# Altium schematic sheet DM1097_CM4.SchDoc: =project_title
size Tabloid; CompanyName: Luxonis Holding; Organization: Luxonis Holding; Address1: 1925 Harmony Park Drive; Address2: Westminster, CO; Address3: 80234; Address4: United States; SheetNumber: 9; SheetTotal: 17
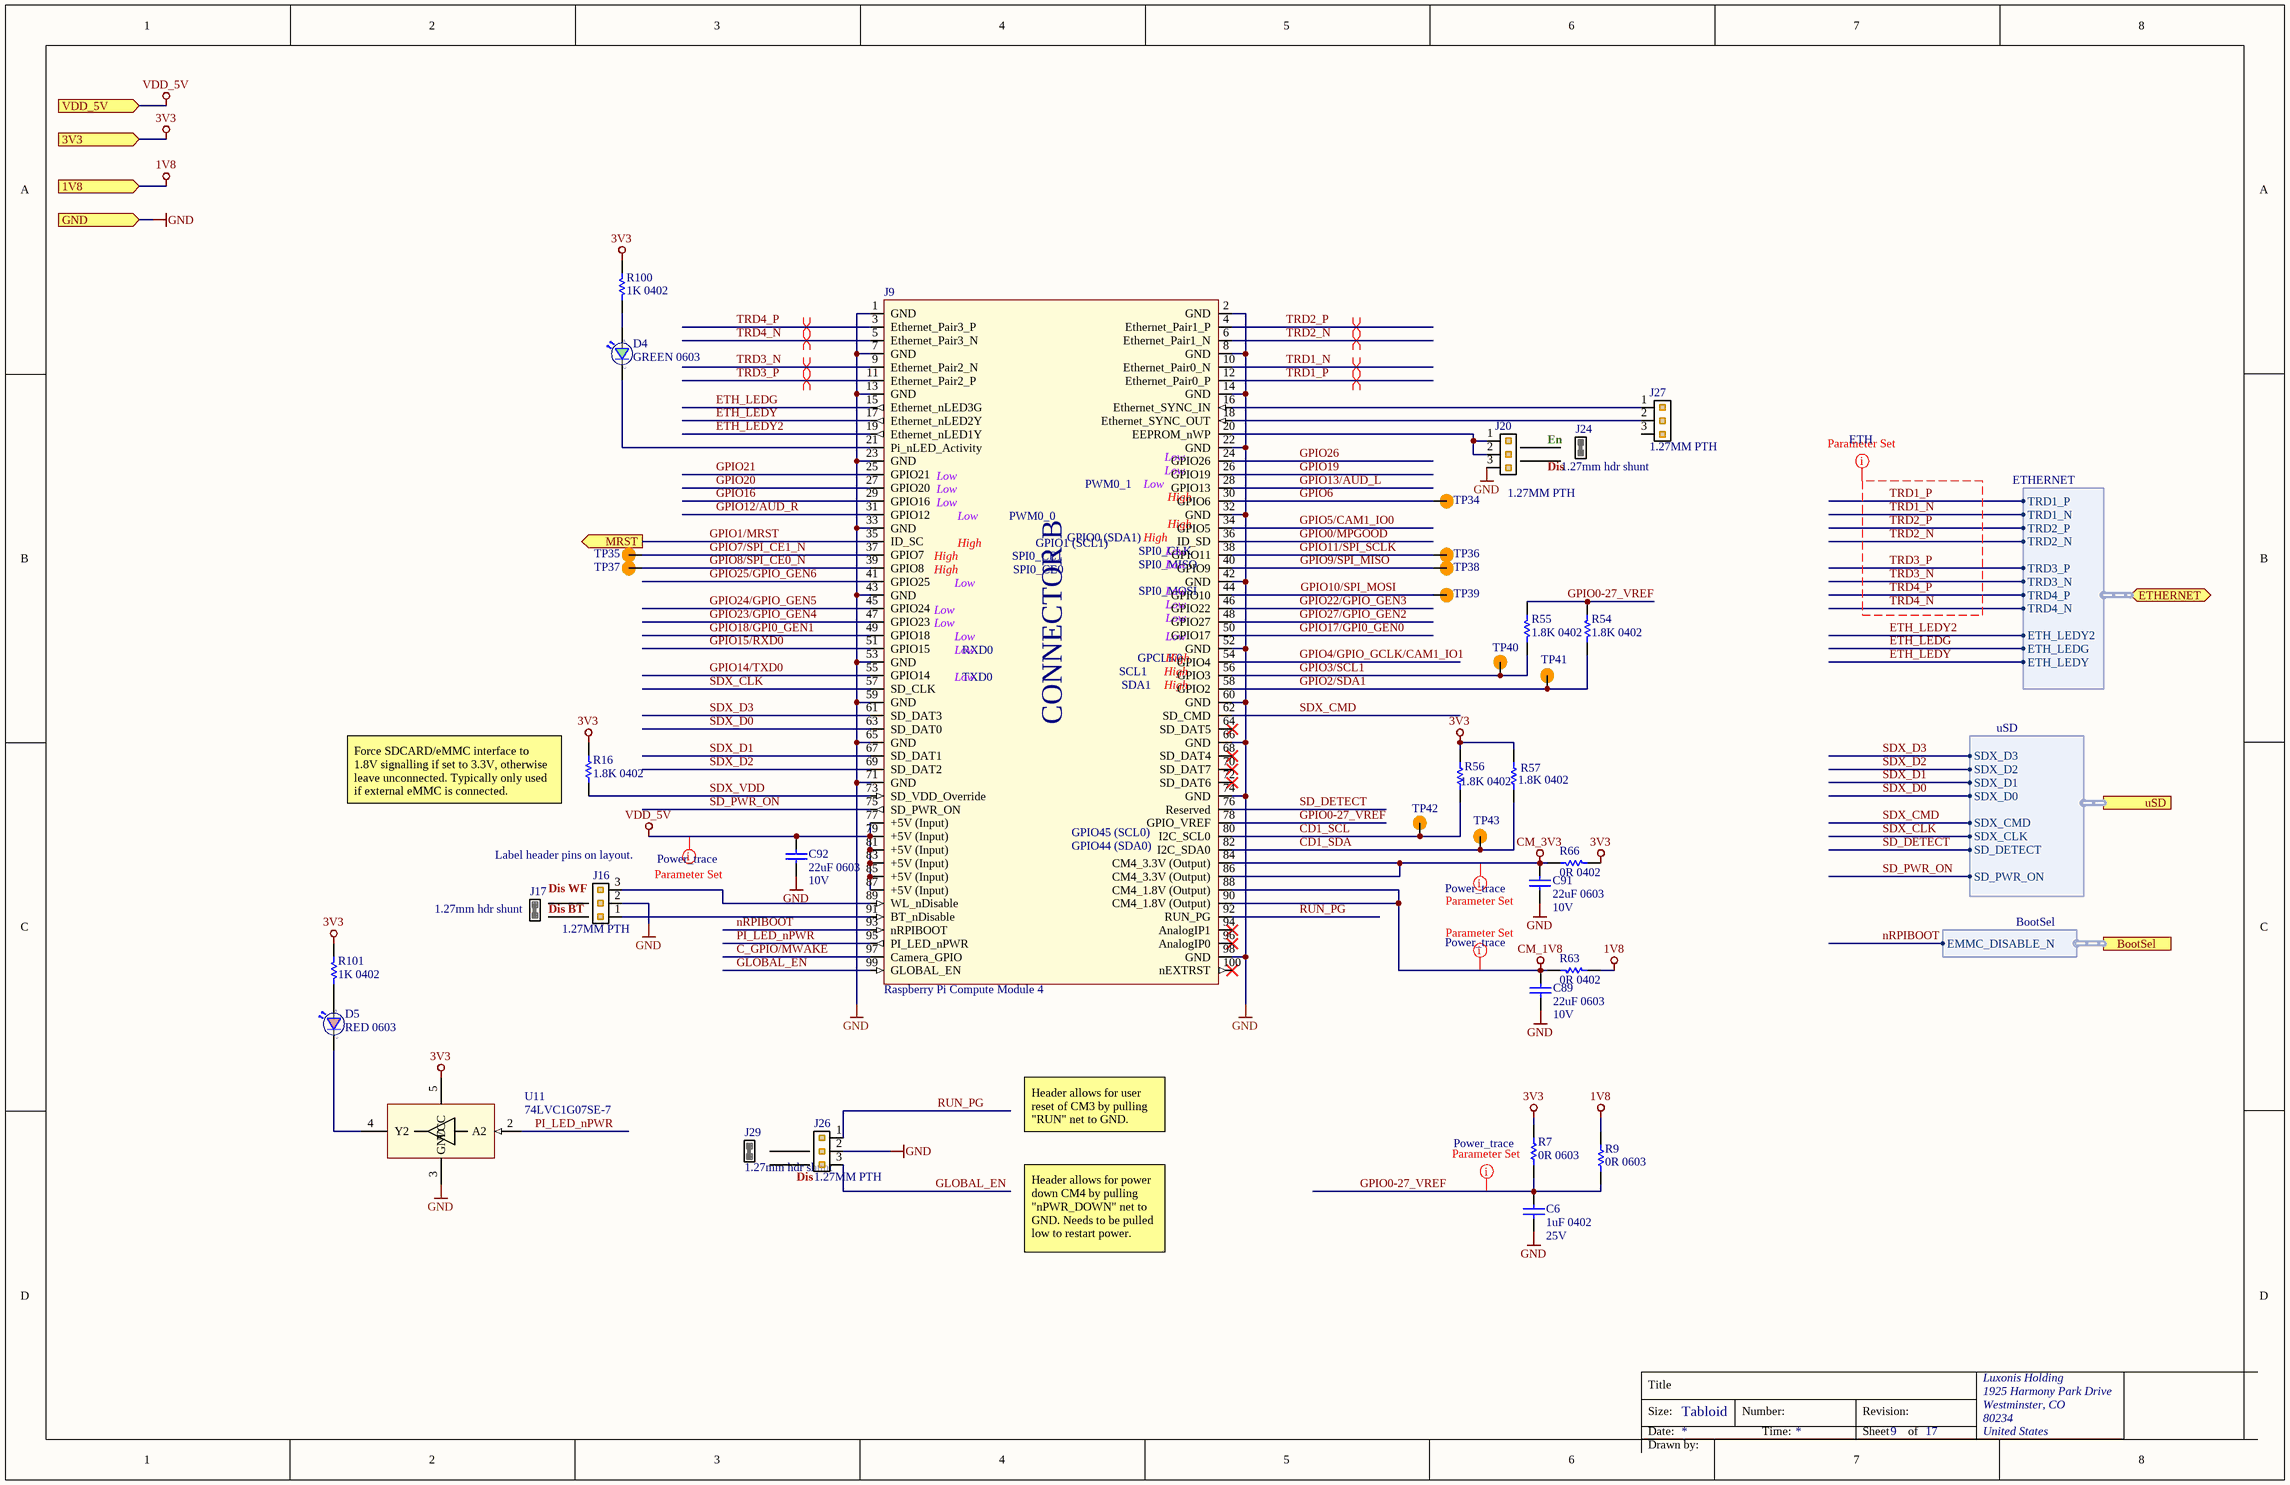
[diagram p0: DM1097_CM4.SchDoc]

## Parts
C6  1uF 0402  Voltage Rating: 25V  [CAPC0402(1005)70_N]
C89  22uF 0603  Voltage Rating: 10V  [CAPC0603(1608)100_N]
C91  22uF 0603  Voltage Rating: 10V  [CAPC0603(1608)100_N]
C92  22uF 0603  Voltage Rating: 10V  [CAPC0603(1608)100_N]
D4  GREEN 0603  [SML_D1xx8W]
D5  RED 0603  [SML_D1xx8W]
J9  Raspberry Pi Compute Module 4  [CM4-Connector-B]
J16  1.27MM PTH  [GRPB031VWVN-RC]
J17  1.27mm hdr shunt  [M50-1900005]
J20  1.27MM PTH  [GRPB031VWVN-RC]
J24  1.27mm hdr shunt  [M50-1900005]
J26  1.27MM PTH  [GRPB031VWVN-RC]
J27  1.27MM PTH  [GRPB031VWVN-RC]
J29  1.27mm hdr shunt  [M50-1900005]
R7  0R 0603  [RESC0603(1608)_N]
R9  0R 0603  [RESC0603(1608)_N]
R16  1.8K 0402  [RESC0402(1005)_N]
R54  1.8K 0402  [RESC0402(1005)_N]
R55  1.8K 0402  [RESC0402(1005)_N]
R56  1.8K 0402  [RESC0402(1005)_N]
R57  1.8K 0402  [RESC0402(1005)_N]
R63  0R 0402  [RESC0402(1005)_N]
R66  0R 0402  [RESC0402(1005)_N]
R100  1K 0402  [RESC0402(1005)_N]
R101  1K 0402  [RESC0402(1005)_N]
TP34  TP100_200_NS  [TP100_200_NS]  (value not drawn)  (no BOM)
TP35  TP100_200_NS  [TP100_200_NS]  (value not drawn)  (no BOM)
TP36  TP100_200_NS  [TP100_200_NS]  (value not drawn)  (no BOM)
TP37  TP100_200_NS  [TP100_200_NS]  (value not drawn)  (no BOM)
TP38  TP100_200_NS  [TP100_200_NS]  (value not drawn)  (no BOM)
TP39  TP100_200_NS  [TP100_200_NS]  (value not drawn)  (no BOM)
TP40  TP100_200_NS  [TP100_200_NS]  (value not drawn)  (no BOM)
TP41  TP100_200_NS  [TP100_200_NS]  (value not drawn)  (no BOM)
TP42  TP100_200_NS  [TP100_200_NS]  (value not drawn)  (no BOM)
TP43  TP100_200_NS  [TP100_200_NS]  (value not drawn)  (no BOM)
U11  74LVC1G07SE-7  [74LVC1G07SE-7]

## Ports
1V8 (in), 3V3 (in), BootSel (harness BootSel), ETHERNET (bidir, harness ETHERNET), GND (in), MRST (out), uSD (harness uSD), VDD_5V (in)

## Harnesses
BootSel: EMMC_DISABLE_N
ETHERNET: TRD1_P, TRD1_N, TRD2_P, TRD2_N, TRD3_P, TRD3_N, TRD4_P, TRD4_N, ETH_LEDG, ETH_LEDY, ETH_LEDY2
uSD: SDX_D2, SDX_D3, SDX_CMD, SDX_CLK, SDX_D0, SDX_D1, SD_PWR_ON, SD_DETECT

## Nets
1V8: R9.2 R63.1 ; port 1V8
3V3: R7.2 R16.2 R56.2 R57.2 R66.1 R100.2 R101.2 U11.5(VCC) ; port 3V3
CM_1V8: C89.1 J9.88(CM4_1.8V_(Output)) J9.90(CM4_1.8V_(Output)) R63.2
CM_3V3: C91.1 J9.84(CM4_3.3V_(Output)) J9.86(CM4_3.3V_(Output)) R66.2
GND: C6.1 C89.2 C91.2 C92.2 J9.1(GND) J9.2(GND) J9.7(GND) J9.8(GND) J9.13(GND) J9.14(GND) J9.22(GND) J9.23(GND) J9.32(GND) J9.33(GND) J9.42(GND) J9.43(GND) J9.52(GND) J9.53(GND) J9.59(GND) J9.60(GND) J9.65(GND) J9.66(GND) J9.71(GND) J9.74(GND) J9.98(GND) J16.2 J20.3 J26.2 U11.3(GND) ; port GND
VDD_5V: C92.1 J9.77(+5V_(Input)) J9.79(+5V_(Input)) J9.81(+5V_(Input)) J9.83(+5V_(Input)) J9.85(+5V_(Input)) J9.87(+5V_(Input)) ; port VDD_5V
C_GPIO/MWAKE: J9.97(Camera_GPIO)
CD1_SCL: J9.80(I2C_SCL0) R56.1 TP42.1
CD1_SDA: J9.82(I2C_SDA0) R57.1 TP43.1
ETH_LEDG: J9.15(Ethernet_nLED3G) ; port ETHERNET.ETH_LEDG
ETH_LEDY: J9.17(Ethernet_nLED2Y) ; port ETHERNET.ETH_LEDY
ETH_LEDY2: J9.19(Ethernet_nLED1Y) ; port ETHERNET.ETH_LEDY2
GLOBAL_EN: J9.99(GLOBAL_EN) J26.3
GPIO0-27_VREF: C6.2 J9.78(GPIO_VREF) R7.1 R9.1 R54.2 R55.2
GPIO0/MPGOOD: J9.36(ID_SD)
GPIO1/MRST: J9.35(ID_SC) ; port MRST
GPIO2/SDA1: J9.58(GPIO2) R54.1 TP41.1
GPIO3/SCL1: J9.56(GPIO3) R55.1 TP40.1
GPIO4/GPIO_GCLK/CAM1_IO1: J9.54(GPIO4)
GPIO5/CAM1_IO0: J9.34(GPIO5)
GPIO6: J9.30(GPIO6) TP34.1
GPIO7/SPI_CE1_N: J9.37(GPIO7) TP35.1
GPIO8/SPI_CE0_N: J9.39(GPIO8) TP37.1
GPIO9/SPI_MISO: J9.40(GPIO9) TP38.1
GPIO10/SPI_MOSI: J9.44(GPIO10) TP39.1
GPIO11/SPI_SCLK: J9.38(GPIO11) TP36.1
GPIO12/AUD_R: J9.31(GPIO12)
GPIO13/AUD_L: J9.28(GPIO13)
GPIO14/TXD0: J9.55(GPIO14)
GPIO15/RXD0: J9.51(GPIO15)
GPIO16: J9.29(GPIO16)
GPIO17/GPI0_GEN0: J9.50(GPIO17)
GPIO18/GPI0_GEN1: J9.49(GPIO18)
GPIO19: J9.26(GPIO19)
GPIO20: J9.27(GPIO20)
GPIO21: J9.25(GPIO21)
GPIO22/GPIO_GEN3: J9.46(GPIO22)
GPIO23/GPIO_GEN4: J9.47(GPIO23)
GPIO24/GPIO_GEN5: J9.45(GPIO24)
GPIO25/GPIO_GEN6: J9.41(GPIO25)
GPIO26: J9.24(GPIO26)
GPIO27/GPIO_GEN2: J9.48(GPIO27)
nRPIBOOT: J9.93(nRPIBOOT) ; port BootSel.EMMC_DISABLE_N
PI_LED_nPWR: J9.95(PI_LED_nPWR) U11.2(A2)
RUN_PG: J9.92(RUN_PG) J26.1
SD_DETECT: J9.76(Reserved) ; port uSD.SD_DETECT
SD_PWR_ON: J9.75(SD_PWR_ON) ; port uSD.SD_PWR_ON
SDX_CLK: J9.57(SD_CLK) ; port uSD.SDX_CLK
SDX_CMD: J9.62(SD_CMD) ; port uSD.SDX_CMD
SDX_D0: J9.63(SD_DAT0) ; port uSD.SDX_D0
SDX_D1: J9.67(SD_DAT1) ; port uSD.SDX_D1
SDX_D2: J9.69(SD_DAT2) ; port uSD.SDX_D2
SDX_D3: J9.61(SD_DAT3) ; port uSD.SDX_D3
SDX_VDD: J9.73(SD_VDD_Override) R16.1
TRD1_N: J9.10(Ethernet_Pair0_N) ; port ETHERNET.TRD1_N
TRD1_P: J9.12(Ethernet_Pair0_P) ; port ETHERNET.TRD1_P
TRD2_N: J9.6(Ethernet_Pair1_N) ; port ETHERNET.TRD2_N
TRD2_P: J9.4(Ethernet_Pair1_P) ; port ETHERNET.TRD2_P
TRD3_N: J9.9(Ethernet_Pair2_N) ; port ETHERNET.TRD3_N
TRD3_P: J9.11(Ethernet_Pair2_P) ; port ETHERNET.TRD3_P
TRD4_N: J9.5(Ethernet_Pair3_N) ; port ETHERNET.TRD4_N
TRD4_P: J9.3(Ethernet_Pair3_P) ; port ETHERNET.TRD4_P
NetD4_1: D4.1(C) J9.21(Pi_nLED_Activity)
NetD4_2: D4.2(A) R100.1
NetD5_1: D5.1(C) U11.4(Y2)
NetD5_2: D5.2(A) R101.1
NetJ9_16: J9.16(Ethernet_SYNC_IN) J27.1
NetJ9_18: J9.18(Ethernet_SYNC_OUT) J27.2
NetJ9_20: J9.20(EEPROM_nWP) J20.1 J20.2
NetJ9_89: J9.89(WL_nDisable) J16.3
NetJ9_91: J9.91(BT_nDisable) J16.1

Not connected (* = marked no-connect by the designer): J9 64(SD_DAT5)* 68(SD_DAT4)* 70(SD_DAT7)* 72(SD_DAT6)* 94(AnalogIP1)* 96(AnalogIP0)* 100(nEXTRST)*; J27 3

## Layout directives
net class Power_trace: CM_1V8, CM_3V3, GPIO0-27_VREF, VDD_5V
differential pair; net class ETH; differential pair class 100ohm: TRD1_N, TRD1_P, TRD2_N, TRD2_P, TRD3_N, TRD3_P, TRD4_N, TRD4_P
net class ETH; rule Matched Net Lengths [Delay Tolerance = 10ps]: TRD1_N, TRD1_P, TRD2_N, TRD2_P, TRD3_N, TRD3_P, TRD4_N, TRD4_P

## Notes on the sheet
- Dis
- En
- (near R16) Force SDCARD/eMMC interface to 1.8V signalling if set to 3.3V, otherwise leave unconnected. Typically only used if external eMMC is connected.
- (near J16) Label header pins on layout.
- Dis WF
- Dis BT
- Header allows for user reset of CM3 by pulling "RUN" net to GND.
- (near J26) Dis
- Header allows for power down CM4 by pulling "nPWR_DOWN" net to GND. Needs to be pulled low to restart power.
- Title
- Size:
- Date:
- Tabloid
- Number:
- Time:
- Revision:
- Sheet
- of
- Drawn by:
- (in symbol CM4_CONNECTOR_B) Low; PWM0_1; High; PWM0_0; GPIO1 (SCL1); GPIO0 (SDA1); SPI0_CE1; SPI0_CLK; SPI0_CE0; SPI0_MISO; SPI0_MOSI; RXD0; GPCLK0; TXD0; SCL1; SDA1; CONNECTOR B; GPIO45 (SCL0); GPIO44 (SDA0)

## Library data of the parts
C6 = GRM155R61E105KA12D: CAP CER 1UF 25V X5R 0402 10%; Manufacturer 1: Murata; Material: Ceramic; Manufacturer Part Number 1: GRM155R61E105KA12D; Supplier 1: Digi-Key; Stock 1: 200653; Pricing 1: 1=0.10000, 10=0.07100, 100=0.03350, 500=0.02352, 1000=0.01947, 2500=0.01812, 5000=0.01658 (USD); RoHS: Yes; Mount: Surface Mount; Case/Package: 0402; Weight: 0.000212oz; Case Code (Metric): 1005; Case Code (Imperial): 0402; Min Operating Temperature: -55°C; Max Operating Temperature: 85°C; Tolerance: 10%; Capacitance: 1uF; Dielectric: X5R; Voltage Rating (DC): 25V; Packaging: Tape and Reel; Package Quantity: 10000; Termination: SMD/SMT; Voltage: 25V; Length: 1mm; Height: 0.5mm; Width: 0.5mm; Thickness: 0.022inch; Depth: 0.5mm; Lead Free: Lead Free; REACH SVHC: No SVHC; ComponentLink1URL: https://datasheet.ciiva.com/22732/1666664-22732122.pdf?src-supplier=Element14; ComponentLink1Description: https://datasheet.ciiva.com/22732/1666664-22732122.pdf?src-supplier=Element14; ComponentLink2URL: https://datasheet.ciiva.com/7719/1666664-7719006.pdf?src-supplier=Element14; ComponentLink2Description: https://datasheet.ciiva.com/7719/1666664-7719006.pdf?src-supplier=Element14; Supplier Part Number 1: 490-10017-1-ND; Supplier 2: Arrow; Supplier 3: TTI; Supplier Part Number 2: GRM155R61E105KA12D; Supplier Part Number 3: GRM155R61E105KA12D
C89 C91 C92 = GRM188R61A226ME15D: CAP CER 22UF 10V X5R 0603 20%; Manufacturer 1: Murata; Material: Ceramic; Manufacturer Part Number 1: GRM188R61A226ME15D; ComponentLink1URL: https://datasheet.ciiva.com/46444/1769893-46444975.pdf?src-supplier=Element14; ComponentLink1Description: https://datasheet.ciiva.com/46444/1769893-46444975.pdf?src-supplier=Element14; Supplier 1: Digi-Key; Stock 1: 984716; Pricing 1: 1=0.31000, 10=0.21500, 100=0.12160, 500=0.08584, 1000=0.07512 (USD); RoHS: Yes; Mount: Surface Mount; Case/Package: 0603; Weight: 0.000222oz; Case Code (Metric): 1608; Case Code (Imperial): 0603; Min Operating Temperature: -55°C; Max Operating Temperature: 85°C; Capacitance: 22uF; Tolerance: 20%; Packaging: Tape and Reel; Dielectric: X5R; Voltage Rating (DC): 10V; Termination: SMD/SMT; Package Quantity: 4000; Length: 1.6mm; Height: 0.8mm; Width: 0.8mm; Thickness: 0.039inch; Depth: 0.8mm; REACH SVHC: No SVHC; Lead Free: Lead Free; Supplier Part Number 1: 490-10476-1-ND
D4 = SML-D12M8WT86: LED GREEN DIFFUSED 0603 SMD Green 572nm LED Indication - Discrete 2.2V 0603 (1608 Metric); Manufacturer: Rohm; Colour: Green,Yellow; Lens Colour: White,Clear,Diffused; Lens Style: Diffused,Colorless,Rectangular; Forward Current: 20mA; Luminous Intensity: 25mcd; Number of LEDs: 1; Viewing Angle: 160°; Lens Color: White,Diffused; Supplier 1: Digi-Key; Stock 1: 112971; Pricing 1: 1=0.33000, 10=0.23900, 100=0.11340, 500=0.07560, 1000=0.05922 (USD); Mount: Surface Mount; Case/Package: 0603; Number of Pins: 2; Case Code (Metric): 1608; Case Code (Imperial): 0603; Min Operating Temperature: -40°C; Max Operating Temperature: 85°C; Forward Voltage: 2.2V; Packaging: Tape and Reel; Dominant Wavelength: 572nm; Wavelength: 572nm; Illumination Colour: Green; Package Quantity: 1; Test Current: 20mA; Lens Transparency: Diffused; Length: 1.6mm; Height: 0.65mm; Width: 0.8mm; Radiation Hardening: No; REACH SVHC: Unknown; Lead Free: Lead Free; ComponentLink1URL: https://datasheet.ciiva.com/11774/0900766b80df3ada-11774260.pdf; ComponentLink1Description: https://datasheet.ciiva.com/11774/0900766b80df3ada-11774260.pdf; ComponentLink2URL: https://datasheet.ciiva.com/3161/sml-d1-3161419.pdf; ComponentLink2Description: https://datasheet.ciiva.com/3161/sml-d1-3161419.pdf; ComponentLink3URL: https://datasheet.ciiva.com/2110/sml-d1-2110396.pdf; ComponentLink3Description: https://datasheet.ciiva.com/2110/sml-d1-2110396.pdf; ComponentLink4URL: https://datasheet.ciiva.com/2110/sml-d1-2110397.pdf; ComponentLink4Description: https://datasheet.ciiva.com/2110/sml-d1-2110397.pdf; ComponentLink5URL: https://datasheet.ciiva.com/2110/sml-d1-2110398.pdf; ComponentLink5Description: https://datasheet.ciiva.com/2110/sml-d1-2110398.pdf; Manufacturer Part Number: SML-D12M8WT86; Manufacturer 1: Rohm; Manufacturer Part Number 1: SML-D12M8WT86; RoHS: Yes; Color: Green,Yellow; Illumination Color: Green; ComponentLink6URL: https://datasheet.ciiva.com/11774/0900766b80df3ada-11774260.pdf?src-supplier=RSComponents; ComponentLink6Description: https://datasheet.ciiva.com/11774/0900766b80df3ada-11774260.pdf?src-supplier=RSComponents; ComponentLink7URL: https://datasheet.ciiva.com/3161/sml-d1-3161419.pdf?src-supplier=Avnet; ComponentLink7Description: https://datasheet.ciiva.com/3161/sml-d1-3161419.pdf?src-supplier=Avnet; ComponentLink8URL: https://datasheet.ciiva.com/2110/sml-d1-2110396.pdf?src-supplier=Digi-Key; ComponentLink8Description: https://datasheet.ciiva.com/2110/sml-d1-2110396.pdf?src-supplier=Digi-Key; ComponentLink9URL: https://datasheet.ciiva.com/2110/sml-d1-2110397.pdf?src-supplier=Digi-Key; ComponentLink9Description: https://datasheet.ciiva.com/2110/sml-d1-2110397.pdf?src-supplier=Digi-Key; ComponentLink10URL: https://datasheet.ciiva.com/2110/sml-d1-2110398.pdf?src-supplier=Digi-Key; ComponentLink10Description: https://datasheet.ciiva.com/2110/sml-d1-2110398.pdf?src-supplier=Digi-Key; Supplier Part Number 1: 511-1578-1-ND
D5 = SML-D12U8WT86: LED RED DIFFUSED 0603 SMD Red 620nm LED Indication - Discrete 2.2V 0603 (1608 Metric); Manufacturer 1: Rohm; Lens Style: Rectangular,Diffused,Colorless; Forward Current: 20mA; Luminous Intensity: 63mcd; Number of LEDs: 1; Viewing Angle: 160°; Lens Color: White,Clear,Diffused; Supplier 1: Digi-Key; Stock 1: 63748; Pricing 1: 1=0.33000, 10=0.23900, 100=0.11340, 500=0.07560, 1000=0.05922 (USD); Mount: Surface Mount; Case/Package: 0603; Number of Pins: 2; Case Code (Metric): 1608; Case Code (Imperial): 0603; Min Operating Temperature: -40°C; Max Operating Temperature: 85°C; Forward Voltage: 2.2V; Packaging: Tape and Reel; Dominant Wavelength: 620nm; Wavelength: 620nm; Package Quantity: 1; Test Current: 20mA; Lens Transparency: Diffused; Length: 1.6mm; Height: 0.65mm; Width: 0.8mm; Radiation Hardening: No; REACH SVHC: No SVHC; Lead Free: Lead Free; ComponentLink1URL: https://datasheet.ciiva.com/11774/0900766b80df3ada-11774020.pdf?src-supplier=RSComponents; ComponentLink1Description: https://datasheet.ciiva.com/11774/0900766b80df3ada-11774020.pdf?src-supplier=RSComponents; ComponentLink2URL: https://datasheet.ciiva.com/2110/sml-d1-2110375.pdf?src-supplier=Digi-Key; ComponentLink2Description: https://datasheet.ciiva.com/2110/sml-d1-2110375.pdf?src-supplier=Digi-Key; ComponentLink3URL: https://datasheet.ciiva.com/2110/sml-d1-2110376.pdf?src-supplier=Digi-Key; ComponentLink3Description: https://datasheet.ciiva.com/2110/sml-d1-2110376.pdf?src-supplier=Digi-Key; ComponentLink4URL: https://datasheet.ciiva.com/2110/sml-d1-2110377.pdf?src-supplier=Digi-Key; ComponentLink4Description: https://datasheet.ciiva.com/2110/sml-d1-2110377.pdf?src-supplier=Digi-Key; ComponentLink5URL: https://datasheet.ciiva.com/9324/sml-d1-9324826.pdf?src-supplier=Avnet; ComponentLink5Description: https://datasheet.ciiva.com/9324/sml-d1-9324826.pdf?src-supplier=Avnet; RoHS: Yes; Color: Red; Illumination Color: Red; ComponentLink6URL: https://datasheet.ciiva.com/17420/sml-d1-17420939.pdf?src-supplier=Avnet+Europe; ComponentLink6Description: https://datasheet.ciiva.com/17420/sml-d1-17420939.pdf?src-supplier=Avnet+Europe; Supplier Part Number 1: 511-1580-1-ND; Manufacturer Part Number 1: SML-D12U8WT86
J9 = CM4_CONNECTOR_B: Raspberry Pi Compute Module 4 Hirose connector B; Manufacturer Part Number 1: DF40HC(3.0)-100DS-0.4V(51; ComponentLink1Description: https://datasheet.ciiva.com/46636/ed-df40-20140305-46636517.pdf?src-supplier=Digi-Key; ComponentLink1URL: https://datasheet.ciiva.com/46636/ed-df40-20140305-46636517.pdf?src-supplier=Digi-Key; ComponentLink2Description: https://datasheet.ciiva.com/18562/ed-df40-20140305-18562189.pdf?src-supplier=Digi-Key; ComponentLink2URL: https://datasheet.ciiva.com/18562/ed-df40-20140305-18562189.pdf?src-supplier=Digi-Key; ComponentLink3Description: https://datasheet.ciiva.com/13559/ed-df40-20140305-13559540.pdf?src-supplier=Mouser; ComponentLink3URL: https://datasheet.ciiva.com/13559/ed-df40-20140305-13559540.pdf?src-supplier=Mouser; ComponentLink4Description: https://datasheet.ciiva.com/18562/ed-df40-20140305-18562462.pdf?src-supplier=Digi-Key; ComponentLink4URL: https://datasheet.ciiva.com/18562/ed-df40-20140305-18562462.pdf?src-supplier=Digi-Key; Manufacturer 1: Hirose
J16 J20 J26 J27 = GRPB031VWVN-RC: CONN HEADER VERT 3POS 1.27MM; Manufacturer 1: Sullins; Number of Positions: 3; Connector Type: Male Pin; Pitch: 0.05inch; Manufacturer Part Number 1: GRPB031VWVN-RC; Supplier 1: Digi-Key; Stock 1: 114623; Pricing 1: 1=0.28000, 10=0.26100, 100=0.18300, 500=0.15688, 1000=0.13073, 5000=0.11205, 10000=0.10790 (USD); RoHS: Yes; Mount: Through Hole; Contact Plating: Gold; Package Quantity: 1; Number of Rows: 1; Packaging: Bulk; Termination: Solder; Contact Mating Length: 0.118inch; Lead Free: Lead Free; ComponentLink1URL: https://datasheet.ciiva.com/726/71-grpb-1vwvn-rc-10957-c-726649.pdf?src-supplier=Digi-Key; ComponentLink1Description: https://datasheet.ciiva.com/726/71-grpb-1vwvn-rc-10957-c-726649.pdf?src-supplier=Digi-Key; Supplier 2: Future Electronics; Supplier Part Number 1: S9014E-03-ND; Supplier Part Number 2: GRPB031VWVN-RC-BAG
J17 J24 J29 = M50-1900005: CONN SHUNT 1.27MM BLACK; Manufacturer 1: Harwin; Number of Positions: 2; Number of Contacts: 3; Max Current Rating: 1A; Contact Resistance: 20mR; Insulation Resistance: 1R; Voltage Rating: 500V; Manufacturer Part Number 1: M50-1900005; RoHS: Yes; Contact Plating: Gold; Contact Material: Copper Alloy; Color: Black; Housing Material: Nylon; Housing Color: Black; Min Operating Temperature: -40°C; Max Operating Temperature: 105°C; Package Quantity: 1000; Packaging: Bulk; Number of Rows: 1; Orientation: Straight; Length: 2.5mm; Height: 0.118inch; Radiation Hardening: No; REACH SVHC: No SVHC; Flammability Rating: UL94 V-0; ComponentLink1URL: https://datasheet.ciiva.com/767/m50-19x-767925.pdf?src-supplier=Digi-Key; ComponentLink1Description: https://datasheet.ciiva.com/767/m50-19x-767925.pdf?src-supplier=Digi-Key; ComponentLink2URL: https://datasheet.ciiva.com/1412/1836978-1412124.pdf?src-supplier=Element14; ComponentLink2Description: https://datasheet.ciiva.com/1412/1836978-1412124.pdf?src-supplier=Element14; Supplier 1: Digi-Key; Stock 1: 19754; Pricing 1: 1=0.33000, 10=0.30800, 25=0.26400, 50=0.22440, 100=0.21560, 250=0.19360, 500=0.18480, 1000=0.15400, 2500=0.14080 (USD); Current Rating: 1A; Pitch: 1.27mm; Depth: 3mm; Supplier Part Number 1: 952-1730-ND
R7 R9 = CRCW06030000Z0EA: RES SMD 0 OHM JUMPER 1/10W 0603 0 Ohms Jumper 0.1W, 1/10W Chip Resistor 0603 (1608 Metric) Automotive AEC-Q200 Thick Film; Manufacturer 1: Vishay; Manufacturer Part Number 1: CRCW0603-0000Z0EA; Resistance: 0mR; Power Rating: 100mW; Voltage Rating: 75V; Temperature Coefficient: 100ppm/°C; Tolerance: 5%; Current Rating: 2A; Supplier 1: Digi-Key; Stock 1: 742743; Pricing 1: 1=0.100000, 10=0.034000, 25=0.024400, 50=0.018600, 100=0.013800, 250=0.010480, 500=0.008400, 1000=0.006180 (USD); RoHS: Yes; Mount: Surface Mount; Case/Package: 0603; Weight: 7.1E-05oz; Contact Plating: Tin,Lead; Case Code (Metric): 1608; Case Code (Imperial): 0603; Min Operating Temperature: -55°C; Max Operating Temperature: 155°C; Composition: Thick Film; Termination: SMD/SMT; Packaging: Tape and Reel; Package Quantity: 1; Number of Terminations: 2; Military Standard: Not; Max Power Dissipation: 100mW; Voltage Rating (DC): 75V; Features: Automotive AEC-Q200; Working Voltage: 75V; Length: 1.55mm; Height: 0.02inch; Width: 0.033inch; Depth: 0.85mm; Radiation Hardening: No; Lead Free: Lead Free; REACH SVHC: Unknown; ComponentLink1URL: https://datasheet.ciiva.com/2461/dcrcwe3-2461968.pdf?src-supplier=Digi-Key; ComponentLink1Description: https://datasheet.ciiva.com/2461/dcrcwe3-2461968.pdf?src-supplier=Digi-Key; ComponentLink2URL: https://datasheet.ciiva.com/2461/dcrcwe3-2461969.pdf?src-supplier=Digi-Key; ComponentLink2Description: https://datasheet.ciiva.com/2461/dcrcwe3-2461969.pdf?src-supplier=Digi-Key; ComponentLink3URL: https://datasheet.ciiva.com/2461/dcrcwe3-2461970.pdf?src-supplier=Digi-Key; ComponentLink3Description: https://datasheet.ciiva.com/2461/dcrcwe3-2461970.pdf?src-supplier=Digi-Key; ComponentLink4URL: https://datasheet.ciiva.com/8340/dcrcwe3-8340197.pdf?src-supplier=Avnet; ComponentLink4Description: https://datasheet.ciiva.com/8340/dcrcwe3-8340197.pdf?src-supplier=Avnet; ComponentLink5URL: https://datasheet.ciiva.com/16941/dcrcw-16941302.pdf?src-supplier=Avnet+Europe; ComponentLink5Description: https://datasheet.ciiva.com/16941/dcrcw-16941302.pdf?src-supplier=Avnet+Europe; ComponentLink6URL: https://datasheet.ciiva.com/16199/dcrcwe3-16199063.pdf?src-supplier=Future+Electronics; ComponentLink6Description: https://datasheet.ciiva.com/16199/dcrcwe3-16199063.pdf?src-supplier=Future+Electronics; ComponentLink7URL: https://datasheet.ciiva.com/16725/70201119-16725175.pdf?src-supplier=Allied+Electronics; ComponentLink7Description: https://datasheet.ciiva.com/16725/70201119-16725175.pdf?src-supplier=Allied+Electronics; ComponentLink8URL: https://datasheet.ciiva.com/26316/fld-crcw-e3-data-en-26316615.pdf?src-supplier=Distrelec; ComponentLink8Description: https://datasheet.ciiva.com/26316/fld-crcw-e3-data-en-26316615.pdf?src-supplier=Distrelec; ComponentLink9URL: https://datasheet.ciiva.com/5544/dcrcwe3-109170-5544344.pdf?src-supplier=Mouser; ComponentLink9Description: https://datasheet.ciiva.com/5544/dcrcwe3-109170-5544344.pdf?src-supplier=Mouser; ComponentLink10URL: https://datasheet.ciiva.com/7841/1720486-7841816.pdf?src-supplier=Element14; ComponentLink10Description: https://datasheet.ciiva.com/7841/1720486-7841816.pdf?src-supplier=Element14; ComponentLink11URL: https://datasheet.ciiva.com/7841/1720486-7841817.pdf?src-supplier=Element14; ComponentLink11Description: https://datasheet.ciiva.com/7841/1720486-7841817.pdf?src-supplier=Element14; ComponentLink12URL: https://datasheet.ciiva.com/7841/125364-7841818.pdf?src-supplier=Element14; ComponentLink12Description: https://datasheet.ciiva.com/7841/125364-7841818.pdf?src-supplier=Element14; ComponentLink13URL: https://datasheet.ciiva.com/16721/70201119-16721450.pdf?src-supplier=Allied+Electronics; ComponentLink13Description: https://datasheet.ciiva.com/16721/70201119-16721450.pdf?src-supplier=Allied+Electronics; Supplier Part Number 1: 541-0.0GCT-ND
R16 R54-R57 = RC0402FR-071K8L: RES SMD 1.8K OHM 1% 1/16W 0402; Manufacturer 1: Yageo; Resistance: 1.8kR; Temperature Coefficient: 100ppm/°C; Power Rating: 63mW; Voltage Rating: 50V; Manufacturer Part Number 1: RC0402FR-071K8L; Supplier 1: Digi-Key; Stock 1: 1041820; Pricing 1: 1=0.10000, 10=0.01600, 100=0.00640, 1000=0.00289, 2500=0.00251, 5000=0.00207 (USD); RoHS: Yes; Case/Package: 0402; Case Code (Imperial): 0402; Case Code (Metric): 1005; Min Operating Temperature: -55°C; Max Operating Temperature: 155°C; Tolerance: 1%; Packaging: Tape and Reel; Composition: Thick Film; Package Quantity: 1; Termination: SMD/SMT; Number of Terminations: 2; Max Power Dissipation: 63mW; Military Standard: Not; Features: Moisture Resistant; Working Voltage: 50V; Length: 1mm; Height: 0.016inch; Width: 0.02inch; Depth: 0.5mm; Lead Free: Lead Free; REACH SVHC: Unknown; ComponentLink1URL: https://datasheet.ciiva.com/11819/0900766b80c66297-11819472.pdf?src-supplier=RSComponents; ComponentLink1Description: https://datasheet.ciiva.com/11819/0900766b80c66297-11819472.pdf?src-supplier=RSComponents; ComponentLink2URL: https://datasheet.ciiva.com/2453/pyu-r-int-thick-7-2453530.pdf?src-supplier=Digi-Key; ComponentLink2Description: https://datasheet.ciiva.com/2453/pyu-r-int-thick-7-2453530.pdf?src-supplier=Digi-Key; ComponentLink3URL: https://datasheet.ciiva.com/7849/1018594-7849868.pdf?src-supplier=Element14; ComponentLink3Description: https://datasheet.ciiva.com/7849/1018594-7849868.pdf?src-supplier=Element14; ComponentLink4URL: https://datasheet.ciiva.com/16744/pyu-rc0402-51-rohs-l-6-r-16744223.pdf?src-supplier=Future+Electronics; ComponentLink4Description: https://datasheet.ciiva.com/16744/pyu-rc0402-51-rohs-l-6-r-16744223.pdf?src-supplier=Future+Electronics; ComponentLink5URL: https://datasheet.ciiva.com/7849/1018594-7849867.pdf?src-supplier=Element14; ComponentLink5Description: https://datasheet.ciiva.com/7849/1018594-7849867.pdf?src-supplier=Element14; ComponentLink6URL: https://datasheet.ciiva.com/12667/pyu-rc0402-51-rohs-l-6-r-12667431.pdf?src-supplier=Mouser; ComponentLink6Description: https://datasheet.ciiva.com/12667/pyu-rc0402-51-rohs-l-6-r-12667431.pdf?src-supplier=Mouser; ComponentLink7URL: https://datasheet.ciiva.com/2453/pyu-r-int-thick-7-2453529.pdf?src-supplier=Digi-Key; ComponentLink7Description: https://datasheet.ciiva.com/2453/pyu-r-int-thick-7-2453529.pdf?src-supplier=Digi-Key; ComponentLink8URL: https://datasheet.ciiva.com/2453/pyu-r-int-thick-7-2453531.pdf?src-supplier=Digi-Key; ComponentLink8Description: https://datasheet.ciiva.com/2453/pyu-r-int-thick-7-2453531.pdf?src-supplier=Digi-Key; Supplier 2: Mouser; Supplier Part Number 2: 603-RC0402FR-071K8L; Supplier Part Number 1: 311-1.80KLRCT-ND
R63 R66 = CRCW04020000Z0ED: RES SMD 0 OHM JUMPER 1/16W 0402; Manufacturer 1: Vishay; Resistance: 0mR; Power Rating: 63mW; Voltage Rating: 50V; Temperature Coefficient: 100ppm/°C; Tolerance: 5%; Manufacturer Part Number 1: CRCW04020000Z0ED; Supplier 1: Digi-Key; Stock 1: 855968; Pricing 1: 1=0.10000, 10=0.03400, 25=0.02440, 50=0.01860, 100=0.01380, 250=0.01048, 500=0.00840, 1000=0.00618, 5000=0.00443 (USD); RoHS: Yes; Mount: Surface Mount; Case/Package: 0402; Weight: 2.3E-05oz; Case Code (Imperial): 0402; Case Code (Metric): 1005; Contact Plating: Tin; Min Operating Temperature: -55°C; Max Operating Temperature: 155°C; Packaging: Tape and Reel; Composition: Thick Film; Voltage Rating (DC): 50V; Package Quantity: 1; Termination: SMD/SMT; Number of Terminations: 2; Military Standard: Not; Max Power Dissipation: 63mW; Features: Automotive AEC-Q200; Length: 1mm; Height: 0.35mm; Width: 0.5mm; Depth: 0.5mm; Radiation Hardening: No; REACH SVHC: Unknown; Lead Free: Lead Free; ComponentLink1URL: https://datasheet.ciiva.com/3255/dcrcwe3-3255944.pdf?src-supplier=Avnet; ComponentLink1Description: https://datasheet.ciiva.com/3255/dcrcwe3-3255944.pdf?src-supplier=Avnet; ComponentLink2URL: https://datasheet.ciiva.com/3255/dcrcwe3-3255945.pdf?src-supplier=Avnet; ComponentLink2Description: https://datasheet.ciiva.com/3255/dcrcwe3-3255945.pdf?src-supplier=Avnet; ComponentLink3URL: https://datasheet.ciiva.com/16881/dcrcwe3-16881413.pdf?src-supplier=Avnet+Europe; ComponentLink3Description: https://datasheet.ciiva.com/16881/dcrcwe3-16881413.pdf?src-supplier=Avnet+Europe; ComponentLink4URL: https://datasheet.ciiva.com/2461/dcrcwe3-2461962.pdf?src-supplier=Digi-Key; ComponentLink4Description: https://datasheet.ciiva.com/2461/dcrcwe3-2461962.pdf?src-supplier=Digi-Key; ComponentLink5URL: https://datasheet.ciiva.com/7841/1720486-7841802.pdf?src-supplier=Element14; ComponentLink5Description: https://datasheet.ciiva.com/7841/1720486-7841802.pdf?src-supplier=Element14; ComponentLink6URL: https://datasheet.ciiva.com/2461/dcrcwe3-2461963.pdf?src-supplier=Digi-Key; ComponentLink6Description: https://datasheet.ciiva.com/2461/dcrcwe3-2461963.pdf?src-supplier=Digi-Key; ComponentLink7URL: https://datasheet.ciiva.com/2461/dcrcwe3-2461964.pdf?src-supplier=Digi-Key; ComponentLink7Description: https://datasheet.ciiva.com/2461/dcrcwe3-2461964.pdf?src-supplier=Digi-Key; ComponentLink8URL: https://datasheet.ciiva.com/7841/1697337-7841468.pdf?src-supplier=Element14; ComponentLink8Description: https://datasheet.ciiva.com/7841/1697337-7841468.pdf?src-supplier=Element14; ComponentLink9URL: https://datasheet.ciiva.com/16761/70200976-16761309.pdf?src-supplier=Allied+Electronics; ComponentLink9Description: https://datasheet.ciiva.com/16761/70200976-16761309.pdf?src-supplier=Allied+Electronics; ComponentLink10URL: https://datasheet.ciiva.com/26311/fld-crcw-e3-data-en-26311550.pdf?src-supplier=Distrelec; ComponentLink10Description: https://datasheet.ciiva.com/26311/fld-crcw-e3-data-en-26311550.pdf?src-supplier=Distrelec; Supplier Part Number 1: 541-0.0JCT-ND
R100 R101 = RC0402FR-071KL: RES SMD 1K OHM 1% 1/16W 0402 1 kOhms ±1% 0.063W, 1/16W Chip Resistor 0402 (1005 Metric) Moisture Resistant Thick Film; Manufacturer 1: Yageo; Temperature Coefficient: 100ppm/°C; Power Rating: 62.5mW; Voltage Rating (DC): 50V; Resistance: 1kR; Manufacturer Part Number 1: RC0402FR-071KL; RoHS: Yes; Number of Pins: 2; Case Code (Imperial): 0402; Case Code (Metric): 1005; Min Operating Temperature: -55°C; Max Operating Temperature: 155°C; Packaging: Tape and Reel; Composition: Thick Film; Voltage Rating: 50V; Military Standard: Not; Termination: SMD/SMT; Length: 1mm; Height: 0.32mm; Width: 0.5mm; Depth: 0.5mm; Lead Free: Lead Free; REACH SVHC: Unknown; ComponentLink1URL: https://datasheet.ciiva.com/11819/0900766b80c66297-11819477.pdf?src-supplier=RSComponents; ComponentLink1Description: https://datasheet.ciiva.com/11819/0900766b80c66297-11819477.pdf?src-supplier=RSComponents; ComponentLink2URL: https://datasheet.ciiva.com/12666/pyu-rc0402-51-rohs-l-6-r-12666741.pdf?src-supplier=Mouser; ComponentLink2Description: https://datasheet.ciiva.com/12666/pyu-rc0402-51-rohs-l-6-r-12666741.pdf?src-supplier=Mouser; ComponentLink3URL: https://datasheet.ciiva.com/17063/pyu-rc0402-51-rohs-l-6-r-17063193.pdf?src-supplier=Future+Electronics; ComponentLink3Description: https://datasheet.ciiva.com/17063/pyu-rc0402-51-rohs-l-6-r-17063193.pdf?src-supplier=Future+Electronics; ComponentLink4URL: https://datasheet.ciiva.com/22747/1018594-22747513.pdf?src-supplier=Element14; ComponentLink4Description: https://datasheet.ciiva.com/22747/1018594-22747513.pdf?src-supplier=Element14; ComponentLink5URL: https://datasheet.ciiva.com/7849/1018594-7849869.pdf?src-supplier=Element14; ComponentLink5Description: https://datasheet.ciiva.com/7849/1018594-7849869.pdf?src-supplier=Element14; ComponentLink6URL: https://datasheet.ciiva.com/7983/1018594-7983502.pdf?src-supplier=Element14; ComponentLink6Description: https://datasheet.ciiva.com/7983/1018594-7983502.pdf?src-supplier=Element14; ComponentLink7URL: https://datasheet.ciiva.com/7849/1018594-7849871.pdf?src-supplier=Element14; ComponentLink7Description: https://datasheet.ciiva.com/7849/1018594-7849871.pdf?src-supplier=Element14; Supplier 1: Digi-Key; Stock 1: 60695854; Pricing 1: 1=0.10000, 10=0.01600, 100=0.00670, 1000=0.00301, 2500=0.00261, 5000=0.00215 (USD); Case/Package: 0402; Tolerance: 1%; Supplier Part Number 1: 311-1.00KLRCT-ND
TP34-TP43 = TEST_POINT
U11 = 74LVC1G07SE-7: SINGLE BUFFER/DRIVER WITH OPEN DRAIN OUTPUT; Manufacturer 1: Diodes Incorporated; Supplier 1: Digi-Key; Manufacturer Part Number 1: 74LVC1G07SE-7; ComponentLink1URL: https://datasheet.ciiva.com/5701/1725615-5701889.pdf?src-supplier=Farnell; ComponentLink1Description: https://datasheet.ciiva.com/5701/1725615-5701889.pdf?src-supplier=Farnell; ComponentLink2URL: https://datasheet.ciiva.com/15094/getdatasheetpartid-92041-15094657.pdf?src-supplier=Verical; ComponentLink2Description: https://datasheet.ciiva.com/15094/getdatasheetpartid-92041-15094657.pdf?src-supplier=Verical; ComponentLink3URL: https://datasheet.ciiva.com/27051/1028128-27051265.pdf?src-supplier=Jameco; ComponentLink3Description: https://datasheet.ciiva.com/27051/1028128-27051265.pdf?src-supplier=Jameco; ComponentLink4URL: https://datasheet.ciiva.com/8260/nc7wz16-8260101.pdf?src-supplier=Avnet; ComponentLink4Description: https://datasheet.ciiva.com/8260/nc7wz16-8260101.pdf?src-supplier=Avnet; ComponentLink5URL: https://datasheet.ciiva.com/17332/nc7wz16-17332853.pdf?src-supplier=Future+Electronics; ComponentLink5Description: https://datasheet.ciiva.com/17332/nc7wz16-17332853.pdf?src-supplier=Future+Electronics; ComponentLink6URL: https://datasheet.ciiva.com/8260/nc7wz16-8260105.pdf?src-supplier=Avnet; ComponentLink6Description: https://datasheet.ciiva.com/8260/nc7wz16-8260105.pdf?src-supplier=Avnet; ComponentLink7URL: https://datasheet.ciiva.com/26096/nc7wz16-26096508.pdf?src-supplier=Avnet+Europe; ComponentLink7Description: https://datasheet.ciiva.com/26096/nc7wz16-26096508.pdf?src-supplier=Avnet+Europe